# EAGLE schematic Vorlage ATmega2560-16AU (EAGLE 9.6.2)
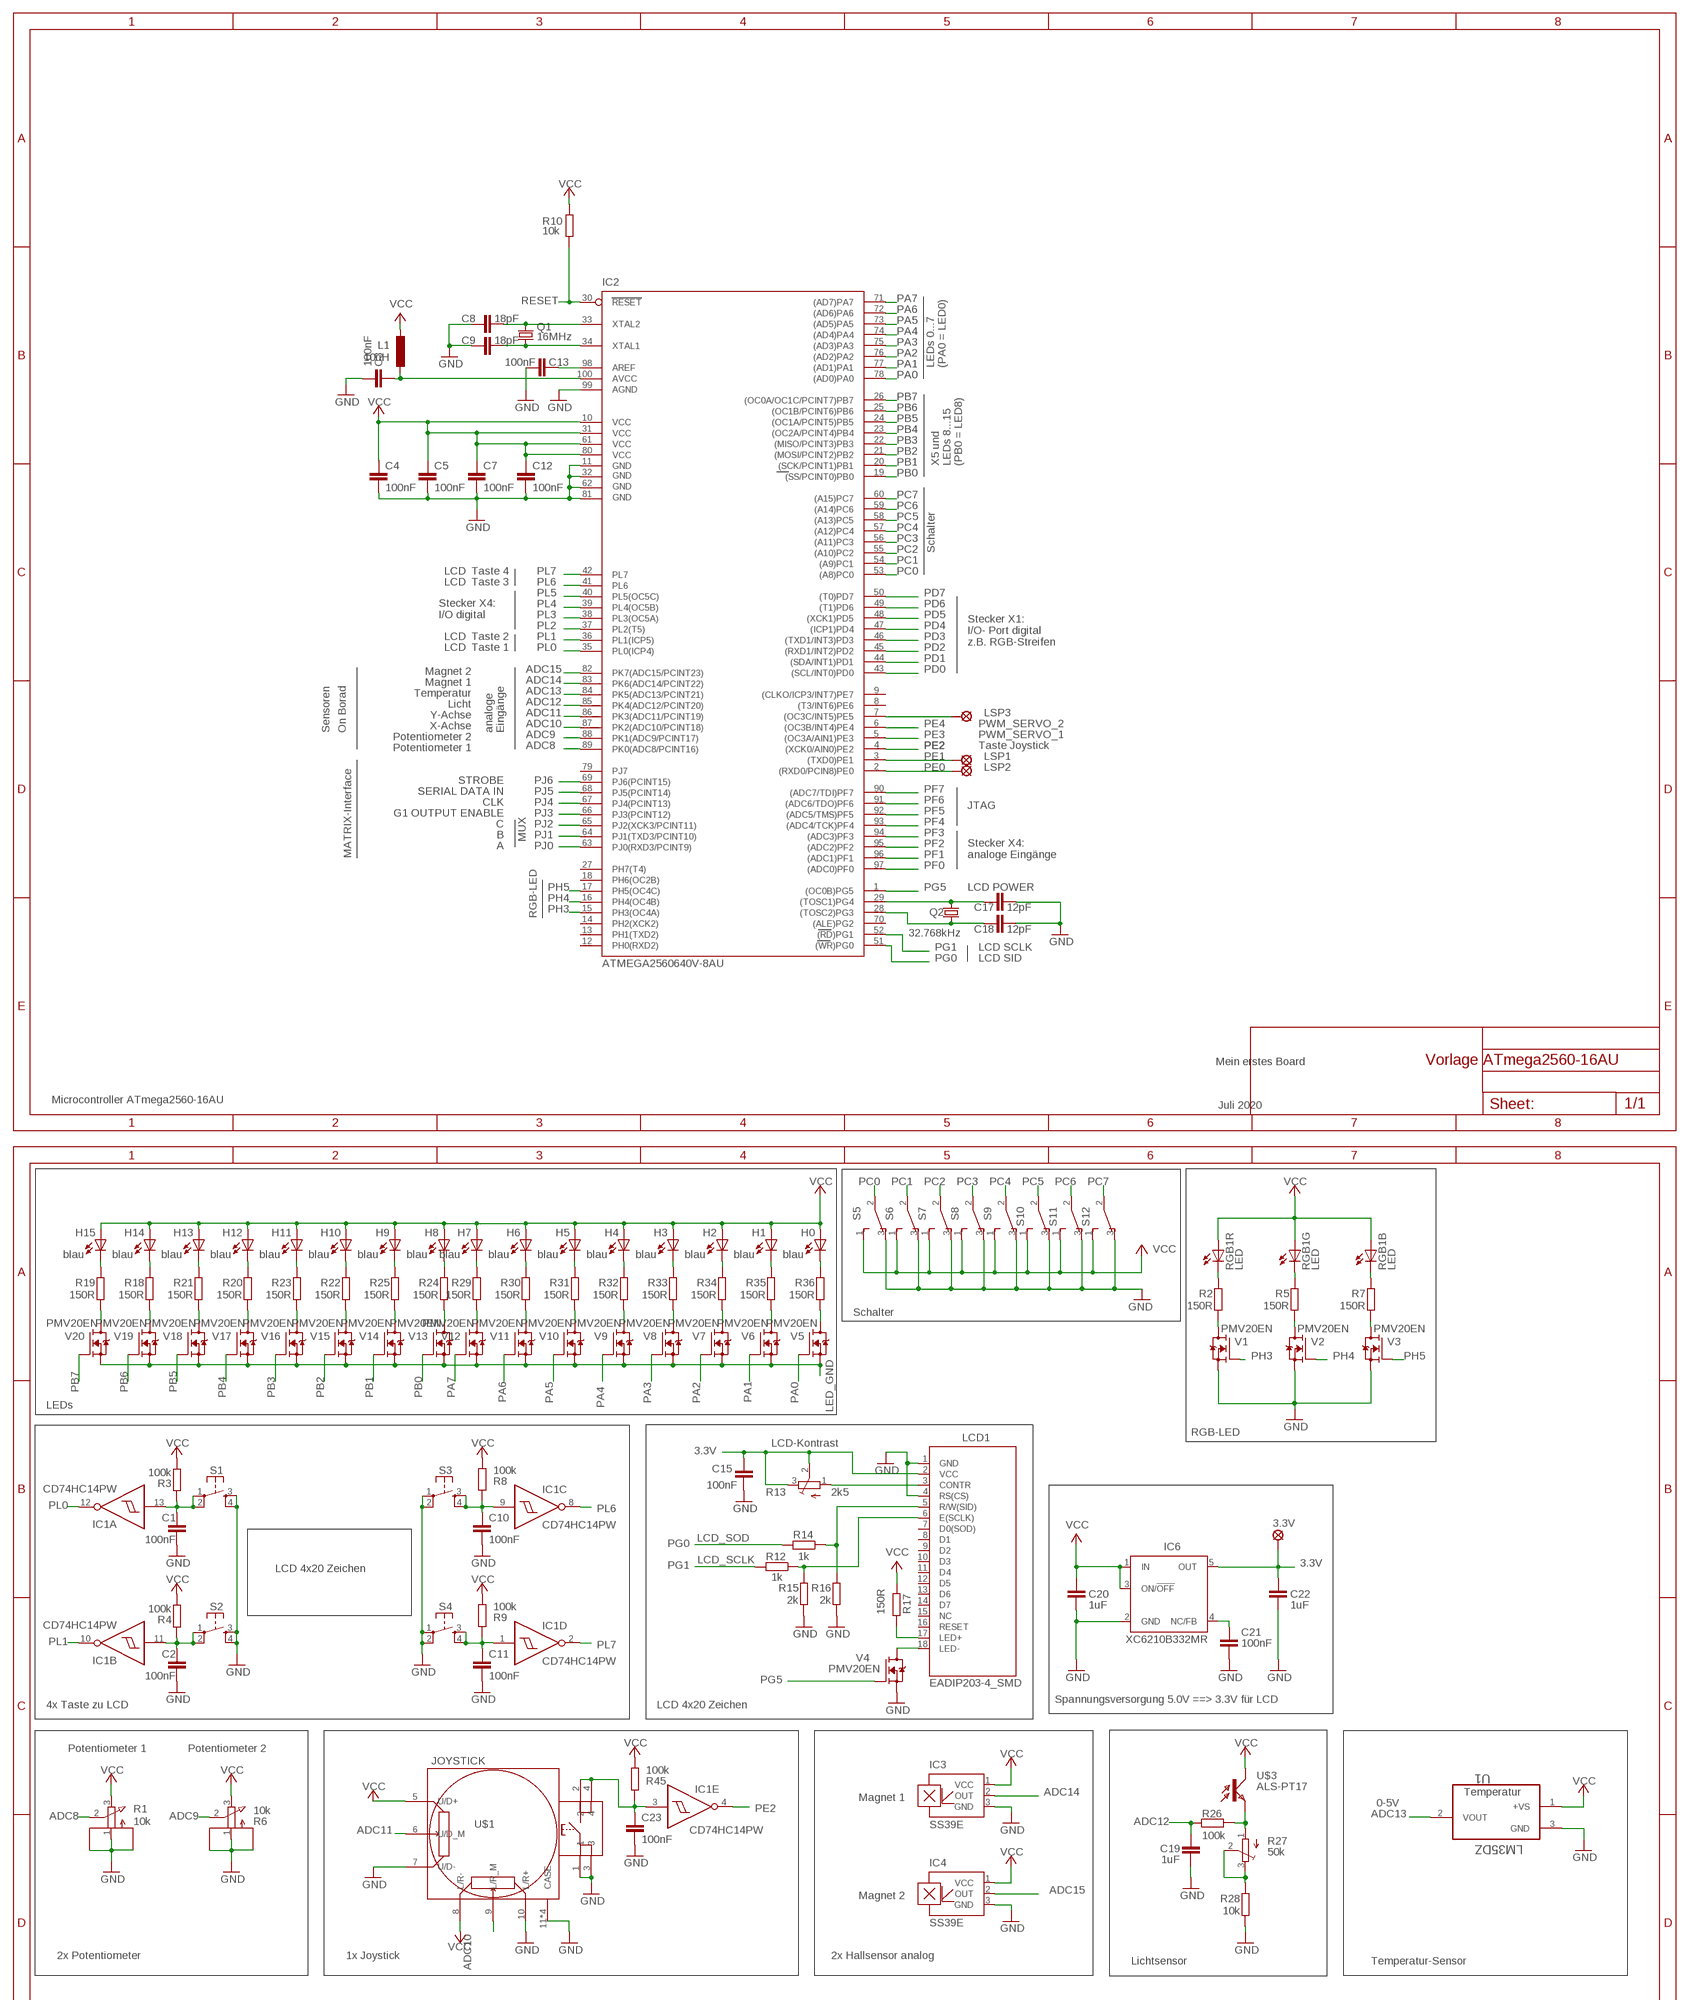
[diagram p0: schematic, sheet 1, part 1 of 2]
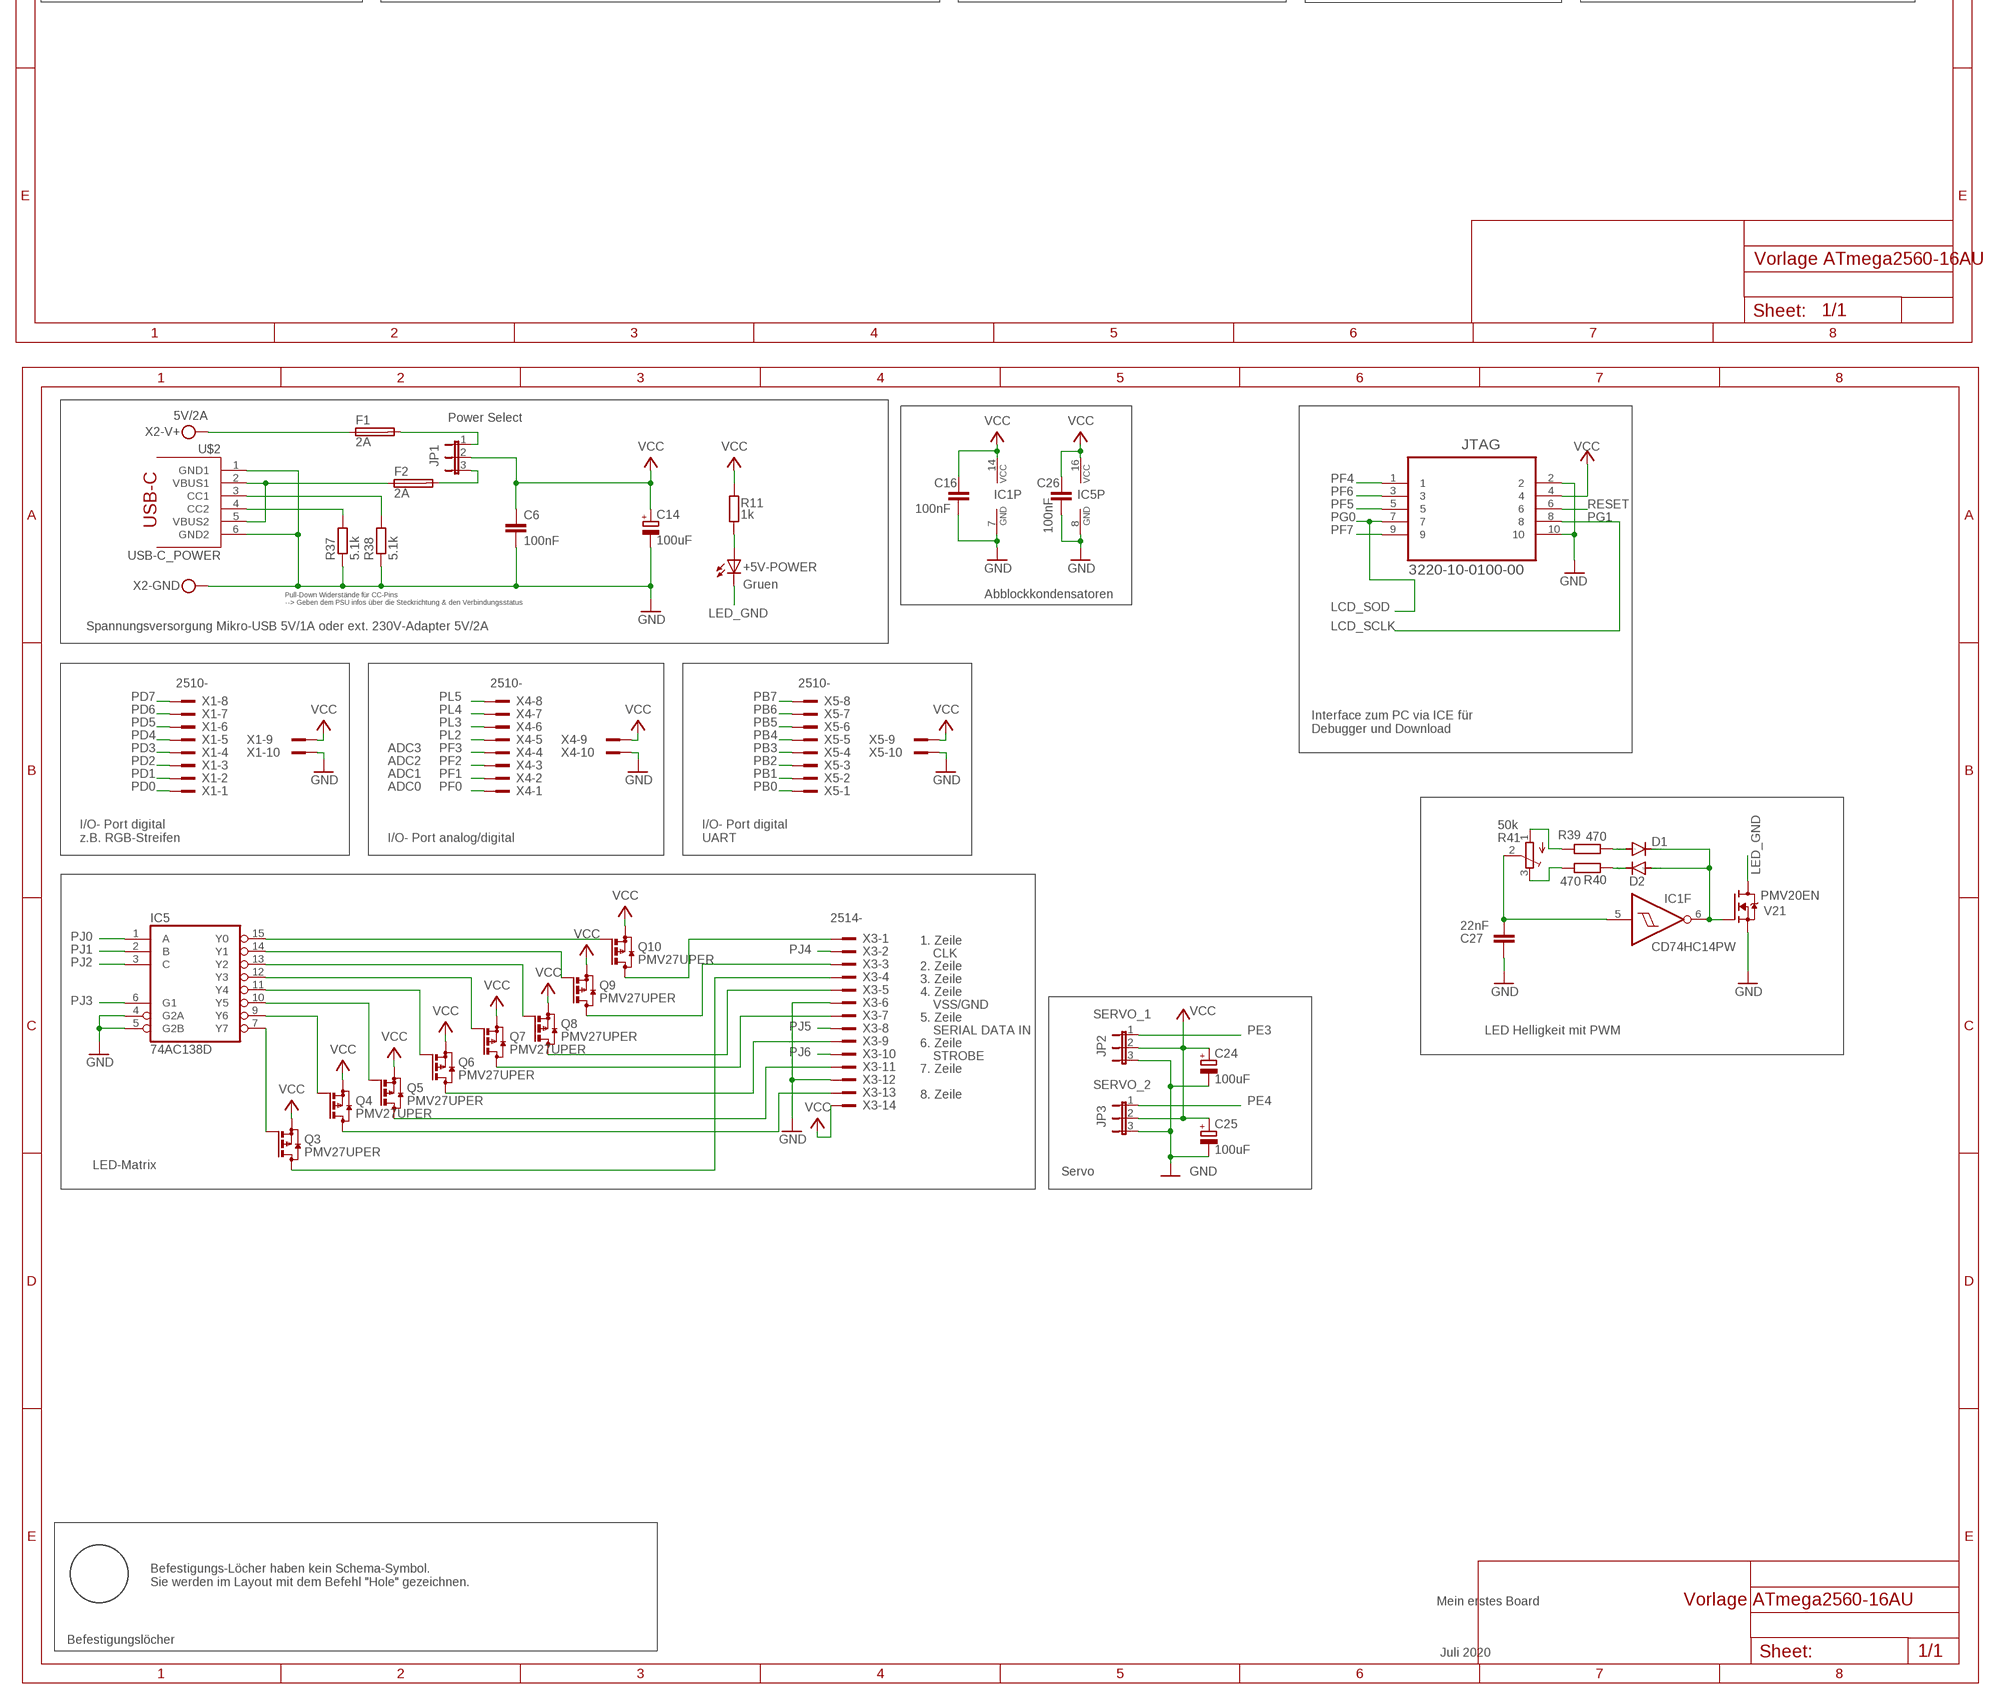
[diagram p1: schematic, sheet 1, part 2 of 2]

## Parts
3.3V  3.3V  LSP11  [LSP11]
+5V-POWER  Gruen  LEDCHIPLED_1206  [CHIPLED_1206]
C1  100nF  C-EUC1206  [C1206]
C2  100nF  C-EUC1206  [C1206]
C3  100nF  C-EUC1206  [C1206]
C4  100nF  C-EUC1206  [C1206]
C5  100nF  C-EUC1206  [C1206]
C6  100nF  C-EUC1206  [C1206]
C7  100nF  C-EUC1206  [C1206]
C8  18pF  C-EUC0805K  [C0805K]
C9  18pF  C-EUC0805K  [C0805K]
C10  100nF  C-EUC1206  [C1206]
C11  100nF  C-EUC1206  [C1206]
C12  100nF  C-EUC1206  [C1206]
C13  100nF  C-EUC1206  [C1206]
C14  100uF  CPOL-EUUD-6,3X8,8  [UD-6,3X5,8_NICHICON]
C15  100nF  C-EUC1206  [C1206]
C16  100nF  C-EUC1206  [C1206]
C17  12pF  C-EUC0805K  [C0805K]
C18  12pF  C-EUC0805K  [C0805K]
C19  1uF  C-EUC1206  [C1206]
C20  1uF  C-EUC1206  [C1206]
C21  100nF  C-EUC1206  [C1206]
C22  1uF  C-EUC1206  [C1206]
C23  100nF  C-EUC1206  [C1206]
C24  100uF  CPOL-EUUD-6,3X8,8  [UD-6,3X5,8_NICHICON]
C25  100uF  CPOL-EUUD-6,3X8,8  [UD-6,3X5,8_NICHICON]
C26  100nF  C-EUC1206  [C1206]
C27  22nF  C-EUC0805  [C0805]
D1  DIODE-SOD123  [SOD123]
D2  DIODE-SOD123  [SOD123]
F1  2A  195601206  [F1206]
F2  2A  195601206  [F1206]
H0  blau  LEDCHIPLED_1206  [CHIPLED_1206]
H1  blau  LEDCHIPLED_1206  [CHIPLED_1206]
H2  blau  LEDCHIPLED_1206  [CHIPLED_1206]
H3  blau  LEDCHIPLED_1206  [CHIPLED_1206]
H4  blau  LEDCHIPLED_1206  [CHIPLED_1206]
H5  blau  LEDCHIPLED_1206  [CHIPLED_1206]
H6  blau  LEDCHIPLED_1206  [CHIPLED_1206]
H7  blau  LEDCHIPLED_1206  [CHIPLED_1206]
H8  blau  LEDCHIPLED_1206  [CHIPLED_1206]
H9  blau  LEDCHIPLED_1206  [CHIPLED_1206]
H10  blau  LEDCHIPLED_1206  [CHIPLED_1206]
H11  blau  LEDCHIPLED_1206  [CHIPLED_1206]
H12  blau  LEDCHIPLED_1206  [CHIPLED_1206]
H13  blau  LEDCHIPLED_1206  [CHIPLED_1206]
H14  blau  LEDCHIPLED_1206  [CHIPLED_1206]
H15  blau  LEDCHIPLED_1206  [CHIPLED_1206]
IC1  CD74HC14PW  7414D  [SO14]
IC2  ATMEGA2560640V-8AU  [TQFP100]
IC3  SS39E  A1301LH  [SOT23-W]
IC4  SS39E  A1301LH  [SOT23-W]
IC5  74AC138D  [SO16]
IC6  XC6210B332MR  LP2985-XXDBVR  [SOT23-DBV]
JP1  Power Select  JP2E  [JP2]
JP2  SERVO_1  JP2E  [JP2]
JP3  SERVO_2  JP2E  [JP2]
JTAG  3220-10-0100-00  FTS-105-01-L-D  [SAMTEC_FTS-105-01-L-D]
L1  10uH  L-EUL2825P  [L2825P]
LCD1  EADIP203-4_SMD  EADIP203-4EADIP203-4SMD  [EADIP203-4SMD]
LSP1  LSP11  [LSP11]
LSP2  LSP11  [LSP11]
LSP3  LSP11  [LSP11]
Q1  16MHz  CRYSTALHC49UP  [HC49UP]
Q2  32.768kHz  CRYSTALTC38H  [TC38H]
Q3  PMV27UPER  BSS84  [SOT23]
Q4  PMV27UPER  BSS84  [SOT23]
Q5  PMV27UPER  BSS84  [SOT23]
Q6  PMV27UPER  BSS84  [SOT23]
Q7  PMV27UPER  BSS84  [SOT23]
Q8  PMV27UPER  BSS84  [SOT23]
Q9  PMV27UPER  BSS84  [SOT23]
Q10  PMV27UPER  BSS84  [SOT23]
R1  10k  EVUA  [EVUF]
R2  150R  R-EU_R1206  [R1206]
R3  100k  R-EU_R1206  [R1206]
R4  100k  R-EU_R1206  [R1206]
R5  150R  R-EU_R1206  [R1206]
R6  10k  EVUA  [EVUF]
R7  150R  R-EU_R1206  [R1206]
R8  100k  R-EU_R1206  [R1206]
R9  100k  R-EU_R1206  [R1206]
R10  10k  R-EU_R1206  [R1206]
R11  1k  R-EU_R1206  [R1206]
R12  1k  R-EU_R1206  [R1206]
R13  2k5  TRIM_EU-3223G  [3223G]
R14  1k  R-EU_R1206  [R1206]
R15  2k  R-EU_R1206  [R1206]
R16  2k  R-EU_R1206  [R1206]
R17  150R  R-EU_R1206  [R1206]
R18  150R  R-EU_R1206  [R1206]
R19  150R  R-EU_R1206  [R1206]
R20  150R  R-EU_R1206  [R1206]
R21  150R  R-EU_R1206  [R1206]
R22  150R  R-EU_R1206  [R1206]
R23  150R  R-EU_R1206  [R1206]
R24  150R  R-EU_R1206  [R1206]
R25  150R  R-EU_R1206  [R1206]
R26  100k  R-EU_R1206  [R1206]
R27  50k  TRIM_EU-3223G  [3223G]
R28  10k  R-EU_R1206  [R1206]
R29  150R  R-EU_R1206  [R1206]
R30  150R  R-EU_R1206  [R1206]
R31  150R  R-EU_R1206  [R1206]
R32  150R  R-EU_R1206  [R1206]
R33  150R  R-EU_R1206  [R1206]
R34  150R  R-EU_R1206  [R1206]
R35  150R  R-EU_R1206  [R1206]
R36  150R  R-EU_R1206  [R1206]
R37  5.1k  R-EU_R0805  [R0805]
R38  5.1k  R-EU_R0805  [R0805]
R39  470  R-EU_R0805  [R0805]
R40  470  R-EU_R0805  [R0805]
R41  50k  TRIM_EU-3223G  [3223G]
R45  100k  R-EU_R1206  [R1206]
RGB1  LED  GM5WA94310AMIT_DIFUSOR  [LED_MIT_DIFUSOR]
S1  TS42_4PAD  [TS42_4PAD]
S2  TS42_4PAD  [TS42_4PAD]
S3  TS42_4PAD  [TS42_4PAD]
S4  TS42_4PAD  [TS42_4PAD]
S5  TL36POSPDT_5MM  [SPDT_5MM]
S6  TL36POSPDT_5MM  [SPDT_5MM]
S7  TL36POSPDT_5MM  [SPDT_5MM]
S8  TL36POSPDT_5MM  [SPDT_5MM]
S9  TL36POSPDT_5MM  [SPDT_5MM]
S10  TL36POSPDT_5MM  [SPDT_5MM]
S11  TL36POSPDT_5MM  [SPDT_5MM]
S12  TL36POSPDT_5MM  [SPDT_5MM]
U1  LM35DZ  [TO127P254X495-3P]
U$1  JOYSTICK  [RKJXV1224005]
U$2  USB-C_POWER  [USB-C]
U$3  ALS-PT17  ALS-PT17-51C  [SOD232-W]
V1  PMV20EN  BSS138  [SOT23]
V2  PMV20EN  BSS138  [SOT23]
V3  PMV20EN  BSS138  [SOT23]
V4  PMV20EN  BSS138  [SOT23]
V5  PMV20EN  BSS138  [SOT23]
V6  PMV20EN  BSS138  [SOT23]
V7  PMV20EN  BSS138  [SOT23]
V8  PMV20EN  BSS138  [SOT23]
V9  PMV20EN  BSS138  [SOT23]
V10  PMV20EN  BSS138  [SOT23]
V11  PMV20EN  BSS138  [SOT23]
V12  PMV20EN  BSS138  [SOT23]
V13  PMV20EN  BSS138  [SOT23]
V14  PMV20EN  BSS138  [SOT23]
V15  PMV20EN  BSS138  [SOT23]
V16  PMV20EN  BSS138  [SOT23]
V17  PMV20EN  BSS138  [SOT23]
V18  PMV20EN  BSS138  [SOT23]
V19  PMV20EN  BSS138  [SOT23]
V20  PMV20EN  BSS138  [SOT23]
V21  PMV20EN  BSS138  [SOT23]
X1  2510-  [PAK100/2500-10]
X2  +5V  MKDSN1,5/2-5,08  [MKDSN1,5/2-5,08]
X3  2514-  [PAK100/2500-14]
X4  2510-  [PAK100/2500-10]
X5  2510-  [PAK100/2500-10]

## Nets
3.3V: 3.3V.MP C15.1 C22.1 IC6.5(OUT) LCD1.2(VCC) R13.2(S) R13.3(E)
ADC8: IC2.89(PK0(ADC8/PCINT16)) R1.2(S)
ADC9: IC2.88(PK1(ADC9/PCINT17)) R6.2(S)
ADC10: IC2.87(PK2(ADC10/PCINT18)) U$1.9(L/R_M)
ADC11: IC2.86(PK3(ADC11/PCINT19)) U$1.6(U/D_M)
ADC12: C19.2 IC2.85(PK4(ADC12/PCINT20)) R26.1
ADC13: IC2.84(PK5(ADC13/PCINT21)) U1.2(VOUT)
ADC14: IC2.83(PK6(ADC14/PCINT22)) IC3.2(OUT)
ADC15: IC2.82(PK7(ADC15/PCINT23)) IC4.2(OUT)
GND [POWER]: C1.2 C2.2 C3.1 C4.2 C5.2 C6.2 C7.2 C8.1 C9.2 C10.2 C11.2 C12.2 C13.1 C14.- C15.2 C16.2 C17.2 C18.2 C19.1 C20.2 C21.2 C22.2 C23.2 C24.- C25.- C26.2 C27.2 IC1.7(P:GND) IC2.11(GND) IC2.32(GND1) IC2.62(GND2) IC2.81(GND3) IC2.99(AGND) IC3.3(GND) IC4.3(GND) IC5.4(G2A) IC5.5(G2B) IC5.8(GND) IC6.2(GND) JP2.3 JP3.3 JTAG.2 JTAG.10 LCD1.1(GND) LCD1.4(RS(CS)) R1.1(A) R1.M1 R1.M2 R6.1(A) R6.M1 R6.M2 R15.1 R16.1 R28.1 R37.1 R38.1 S1.3 S1.4 S2.3 S2.4 S3.1 S3.2 S4.1 S4.2 S5.3(O) S6.3(O) S7.3(O) S8.3(O) S9.3(O) S10.3(O) S11.3(O) S12.3(O) U1.3(GND) U$1.1 U$1.3 U$1.7(U/D-) U$1.10(L/R+) U$1.11(CASE) U$1.12(CASE) U$1.15(CASE) U$1.16(CASE) U$2.1(GND1) U$2.6(GND2) V1.2(S) V2.2(S) V3.2(S) V4.2(S) V21.2(S) X1.10 X2.1.1 X2.1.2 X3.6 X3.12 X4.10 X5.10
H1: H15.C R19.2
H7: H7.C R29.2
LED_GND [POWER]: +5V-POWER.C V5.2(S) V6.2(S) V7.2(S) V8.2(S) V9.2(S) V10.2(S) V11.2(S) V12.2(S) V13.2(S) V14.2(S) V15.2(S) V16.2(S) V17.2(S) V18.2(S) V19.2(S) V20.2(S) V21.3(D)
N$1: R7.2 RGB1.1(B:C)
N$2: R5.2 RGB1.2(G:C)
N$3 [POWER]: F1.2 JP1.1
N$4 [POWER]: F2.2 JP1.3
N$5: R36.1 V5.3(D)
N$6: R35.1 V6.3(D)
N$7: R34.1 V7.3(D)
N$8: R38.2 U$2.3(CC1)
N$9: C23.1 IC1.3(E:I) R45.1 U$1.2 U$1.4
N$10: R37.2 U$2.4(CC2)
N$11: R2.2 RGB1.3(R:C)
N$12: LCD1.18(LED-) V4.3(D)
N$13: R33.1 V8.3(D)
N$14: R32.1 V9.3(D)
N$15: R31.1 V10.3(D)
N$16: R30.1 V11.3(D)
N$17: R29.1 V12.3(D)
N$18: IC2.7((OC3C/INT5)PE5) LSP3.MP
N$19: R26.2 R27.1(A) U$3.E
N$20: R27.2(S) R27.3(E) R28.2
N$21: C1.1 IC1.13(A:I) R3.2 S1.1 S1.2
N$22: C2.1 IC1.11(B:I) R4.2 S2.1 S2.2
N$23: C11.1 IC1.1(D:I) R9.1 S4.3 S4.4
N$24: C10.1 IC1.9(C:I) R8.1 S3.3 S3.4
N$25: C9.1 IC2.34(XTAL1) Q1.1
N$26: C3.2 IC2.100(AVCC) L1.2
N$27: R2.1 V1.3(D)
N$28: R5.1 V2.3(D)
N$29: R7.1 V3.3(D)
N$30: C13.2 IC2.98(AREF)
N$31 [POWER]: F2.1 U$2.2(VBUS1) U$2.5(VBUS2)
N$32: C17.1 IC2.29((TOSC1)PG4) Q2.1
N$33: H6.C R30.2
N$34: LCD1.3(CONTR) R13.1(A)
N$35: C18.1 IC2.28((TOSC2)PG3) Q2.2
N$36: D1.C D2.A IC1.6(F:O) V21.1(G)
N$37: C8.2 IC2.33(XTAL2) Q1.2
N$38: D1.A R39.1
N$39: LCD1.6(E(SCLK)) R12.1 R15.2
N$40: LCD1.5(R/W(SID)) R14.1 R16.2
N$41: D2.C R40.1
N$42: R39.2 R41.1(A)
N$43: R40.2 R41.3(E)
N$44: C27.1 IC1.5(F:I) R41.2(S)
N$46: H14.C R18.2
N$47: H12.C R20.2
N$48: H2.C R34.2
N$49: H4.C R32.2
N$50: H5.C R31.2
N$51: H13.C R21.2
N$52: H10.C R22.2
N$53: H3.C R33.2
N$55: H11.C R23.2
N$56: H8.C R24.2
N$57: H0.C R36.2
N$58: H1.C R35.2
N$59: H9.C R25.2
N$60: +5V-POWER.A R11.1
N$61: R24.1 V13.3(D)
N$63: R25.1 V14.3(D)
N$64: R22.1 V15.3(D)
N$65: R23.1 V16.3(D)
N$66: R20.1 V17.3(D)
N$67: R21.1 V18.3(D)
N$68: R18.1 V19.3(D)
N$69: R19.1 V20.3(D)
N$70: C21.1 IC6.4(NC/FB)
N$75 [POWER]: F1.1 X2.2.1 X2.2.2
N$95: LCD1.17(LED+) R17.1
N$102: IC5.15(Y0) Q10.1(G)
N$103: Q10.3(D) X3.1
N$104: IC5.14(Y1) Q9.1(G)
N$105: IC5.13(Y2) Q8.1(G)
N$106: IC5.12(Y3) Q7.1(G)
N$107: IC5.11(Y4) Q6.1(G)
N$108: IC5.10(Y5) Q5.1(G)
N$109: IC5.9(Y6) Q4.1(G)
N$110: IC5.7(Y7) Q3.1(G)
N$111: Q9.3(D) X3.3
N$112: Q3.3(D) X3.4
N$113: Q8.3(D) X3.5
N$114: Q7.3(D) X3.7
N$115: Q6.3(D) X3.9
N$116: Q5.3(D) X3.11
N$117: Q4.3(D) X3.13
PA0: IC2.78((AD0)PA0) V5.1(G)
PA1: IC2.77((AD1)PA1) V6.1(G)
PA2: IC2.76((AD2)PA2) V7.1(G)
PA3: IC2.75((AD3)PA3) V8.1(G)
PA4: IC2.74((AD4)PA4) V9.1(G)
PA5: IC2.73((AD5)PA5) V10.1(G)
PA6: IC2.72((AD6)PA6) V11.1(G)
PA7: IC2.71((AD7)PA7) V12.1(G)
PB0: IC2.19((SS/PCINT0)PB0) V13.1(G) X5.1
PB1: IC2.20((SCK/PCINT1)PB1) V14.1(G) X5.2
PB2: IC2.21((MOSI/PCINT2)PB2) V15.1(G) X5.3
PB3: IC2.22((MISO/PCINT3)PB3) V16.1(G) X5.4
PB4: IC2.23((OC2A/PCINT4)PB4) V17.1(G) X5.5
PB5: IC2.24((OC1A/PCINT5)PB5) V18.1(G) X5.6
PB6: IC2.25((OC1B/PCINT6)PB6) V19.1(G) X5.7
PB7: IC2.26((OC0A/OC1C/PCINT7)PB7) V20.1(G) X5.8
PC0: IC2.53((A8)PC0) S5.2(P)
PC1: IC2.54((A9)PC1) S6.2(P)
PC2: IC2.55((A10)PC2) S7.2(P)
PC3: IC2.56((A11)PC3) S8.2(P)
PC4: IC2.57((A12)PC4) S9.2(P)
PC5: IC2.58((A13)PC5) S10.2(P)
PC6: IC2.59((A14)PC6) S11.2(P)
PC7: IC2.60((A15)PC7) S12.2(P)
PD0: IC2.43((SCL/INT0)PD0) X1.1
PD1: IC2.44((SDA/INT1)PD1) X1.2
PD2: IC2.45((RXD1/INT2)PD2) X1.3
PD3: IC2.46((TXD1/INT3)PD3) X1.4
PD4: IC2.47((ICP1)PD4) X1.5
PD5: IC2.48((XCK1)PD5) X1.6
PD6: IC2.49((T1)PD6) X1.7
PD7: IC2.50((T0)PD7) X1.8
PE0: IC2.2((RXD0/PCIN8)PE0) LSP2.MP
PE1: IC2.3((TXD0)PE1) LSP1.MP
PE2: IC1.4(E:O) IC2.4((XCK0/AIN0)PE2)
PE3: IC2.5((OC3A/AIN1)PE3) JP2.1
PE4: IC2.6((OC3B/INT4)PE4) JP3.1
PF0: IC2.97((ADC0)PF0) X4.1
PF1: IC2.96((ADC1)PF1) X4.2
PF2: IC2.95((ADC2)PF2) X4.3
PF3: IC2.94((ADC3)PF3) X4.4
PF4: IC2.93((ADC4/TCK)PF4) JTAG.1
PF5: IC2.92((ADC5/TMS)PF5) JTAG.5
PF6: IC2.91((ADC6/TDO)PF6) JTAG.3
PF7: IC2.90((ADC7/TDI)PF7) JTAG.9
PG0: IC2.51((WR)PG0) JTAG.7 R14.2
PG1: IC2.52((RD)PG1) JTAG.8 R12.2
PG5: IC2.1((OC0B)PG5) V4.1(G)
PH3: IC2.15(PH3(OC4A)) V1.1(G)
PH4: IC2.16(PH4(OC4B)) V2.1(G)
PH5: IC2.17(PH5(OC4C)) V3.1(G)
PJ0: IC2.63(PJ0(RXD3/PCINT9)) IC5.1(A)
PJ1: IC2.64(PJ1(TXD3/PCINT10)) IC5.2(B)
PJ2: IC2.65(PJ2(XCK3/PCINT11)) IC5.3(C)
PJ3: IC2.66(PJ3(PCINT12)) IC5.6(G1)
PJ4: IC2.67(PJ4(PCINT13)) X3.2
PJ5: IC2.68(PJ5(PCINT14)) X3.8
PJ6: IC2.69(PJ6(PCINT15)) X3.10
PL0: IC1.12(A:O) IC2.35(PL0(ICP4))
PL1: IC1.10(B:O) IC2.36(PL1(ICP5))
PL2: IC2.37(PL2(T5)) X4.5
PL3: IC2.38(PL3(OC5A)) X4.6
PL4: IC2.39(PL4(OC5B)) X4.7
PL5: IC2.40(PL5(OC5C)) X4.8
PL6: IC1.8(C:O) IC2.41(PL6)
PL7: IC1.2(D:O) IC2.42(PL7)
RESET: IC2.30(RESET) JTAG.6 R10.1
VCC [POWER]: C4.1 C5.1 C6.1 C7.1 C12.1 C14.+ C16.1 C20.1 C24.+ C25.+ C26.1 H0.A H1.A H2.A H3.A H4.A H5.A H6.A H7.A H8.A H9.A H10.A H11.A H12.A H13.A H14.A H15.A IC1.14(P:VCC) IC2.10(VCC) IC2.31(VCC1) IC2.61(VCC2) IC2.80(VCC3) IC3.1(VCC) IC4.1(VCC) IC5.16(VCC) IC6.1(IN) IC6.3(ON/!OFF) JP1.2 JP2.2 JP3.2 JTAG.4 L1.1 Q3.2(S) Q4.2(S) Q5.2(S) Q6.2(S) Q7.2(S) Q8.2(S) Q9.2(S) Q10.2(S) R1.3(E) R3.1 R4.1 R6.3(E) R8.2 R9.2 R10.2 R11.2 R17.2 R45.2 RGB1.4(R:A) RGB1.5(G:A) RGB1.6(B:A) S5.1(S) S6.1(S) S7.1(S) S8.1(S) S9.1(S) S10.1(S) S11.1(S) S12.1(S) U1.1(+VS) U$1.5(U/D+) U$1.8(L/R-) U$3.C X1.9 X3.14 X4.9 X5.9
Unconnected: IC2.8((T3/INT6)PE6) IC2.9((CLKO/ICP3/INT7)PE7) IC2.12(PH0(RXD2)) IC2.13(PH1(TXD2)) IC2.14(PH2(XCK2)) IC2.18(PH6(OC2B)) IC2.27(PH7(T4)) IC2.70((ALE)PG2) IC2.79(PJ7) LCD1.7(D0(SOD)) LCD1.8(D1) LCD1.9(D2) LCD1.10(D3) LCD1.11(D4) LCD1.12(D5) LCD1.13(D6) LCD1.14(D7) LCD1.15(NC) LCD1.16(RESET)

## Notes on the sheet
- LEDs 0...7
  (PA0 = LED0)
- X5 und
  LEDs 8...15
  (PB0 = LED8)
- Schalter
- LCD | Taste 4
- LCD | Taste 3
- Stecker X4:
  I/O digital
- LCD | Taste 2
- Stecker X1:
  I/O- Port digital
  z.B. RGB-Streifen
- LCD | Taste 1
- Magnet 2
- Magnet 1
- Temperatur
- Licht
- Y-Achse
- X-Achse
- PWM_SERVO_2
- Sensoren | On Borad | Potentiometer 2
- analoge
  Eingänge
- PWM_SERVO_1
- Potentiometer 1
- Taste Joystick
- STROBE
- SERIAL DATA IN
- CLK
- G1 OUTPUT ENABLE | JTAG
- C
- B
- A | MUX
- MATRIX-Interface
- Stecker X4:
  analoge Eingänge
- LCD POWER
- RGB-LED
- LCD SCLK
- LCD SID
- Mein erstes Board
- Microcontroller ATmega2560-16AU
- Juli 2020
- Schalter
- LEDs
- RGB-LED
- LCD-Kontrast
- LCD_SOD
- LCD_SCLK
- LCD 4x20 Zeichen
- Spannungsversorgung 5.0V ==> 3.3V für LCD
- 4x Taste zu LCD | LCD 4x20 Zeichen
- Potentiometer 1 | Potentiometer 2
- Magnet 1
- 0-5V
- Magnet 2
- 2x Potentiometer | 1x Joystick | 2x Hallsensor analog
- Lichtsensor | Temperatur-Sensor
- 5V/2A
- Abblockkondensatoren
- Pull-Down Widerstände für CC-Pins
  --> Geben dem PSU infos über die Steckrichtung & den Verbindungsstatus
- LCD_SOD
- Spannungsversorgung Mikro-USB 5V/1A oder ext. 230V-Adapter 5V/2A | LCD_SCLK
- Interface zum PC via ICE für
  Debugger und Download
- ADC3
- ADC2
- ADC1
- ADC0
- I/O- Port digital
  z.B. RGB-Streifen
- I/O- Port analog/digital
- I/O- Port digital
  UART
- 1. Zeile
- CLK
- 2. Zeile
- 3. Zeile
- 4. Zeile
- VSS/GND
- 5. Zeile
- SERIAL DATA IN | LED Helligkeit mit PWM
- 6. Zeile
- STROBE
- 7. Zeile
- 8. Zeile
- LED-Matrix
- Servo
- Befestigungs-Löcher haben kein Schema-Symbol.
  Sie werden im Layout mit dem Befehl "Hole" gezeichnen.
- Mein erstes Board
- Befestigungslöcher
- Juli 2020

## Library data of the parts
3.3V LSP1-LSP3 = solpad:LSP11: SOLDER PAD drill 1.1 mm
+5V-POWER H0 H1-H15 = led:LED: LED OSRAM: - CHIPLED LG R971, LG N971, LY N971, LG Q971, LY Q971, LO R971, LY R971 LH N974, LH R974 LS Q976, LO Q976, LY Q976 LO Q996 - Hyper CHIPLED LW Q18S LB Q993, LB Q99A, LB R99A - SideLED LS A670, LO A670, LY A670, LG A670, LP A670 LB A673, LV A673, LT A673, LW A673 LH A674 LY A675 LS A676, LA A676, LO A676, LY A676, LW A676 LS A679, LY A679, LG A679 - Hyper Micro SIDELED® LS Y876, LA Y876, LO Y876, LY Y876 LT Y87S - SmartLED LW L88C, LW L88S LB L89C, LB L89S, LG L890 LS L89K, LO L89K, LY L89K LS L896, LA L896, LO L896, LY L896 - TOPLED LS T670, LO T670, LY T670, LG T670, LP T670 LSG T670, LSP T670, LSY T670, LOP T670, LYG T670 LG T671, LOG T671, LSG T671 LB T673, LV T673, LT T673, LW T673 LH T674 LS T676, LA T676, LO T676, LY T676, LB T676, LH T676, LSB T676, LW T676 LB T67C, LV T67C, LT T67C, LS T67K, LO T67K, LY T67K, LW E67C LS E67B, LA E67B, LO E67B, LY E67B, LB E67C, LV E67C, LT E67C LW T67C LS T679, LY T679, LG T679 LS T770, LO T770, LY T770, LG T770, LP T770 LB T773, LV T773, LT T773, LW T773 LH T774 LS E675, LA E675, LY E675, LS T675 LS T776, LA T776, LO T776, LY T776, LB T776 LHGB T686 LT T68C, LB T68C - Hyper Mini TOPLED® LB M676 - Mini TOPLED Santana® LG M470 LS M47K, LO M47K, LY M47K Source: http://www.osram.convergy.de LUXEON: - LUMILED® LXK2-PW12-R00, LXK2-PW12-S00, LXK2-PW14-U00, LXK2-PW14-V00 LXK2-PM12-R00, LXK2-PM12-S00, LXK2-PM14-U00 LXK2-PE12-Q00, LXK2-PE12-R00, LXK2-PE12-S00, LXK2-PE14-T00, LXK2-PE14-U00 LXK2-PB12-K00, LXK2-PB12-L00, LXK2-PB12-M00, LXK2-PB14-N00, LXK2-PB14-P00, LXK2-PB14-Q00 LXK2-PR12-L00, LXK2-PR12-M00, LXK2-PR14-Q00, LXK2-PR14-R00 LXK2-PD12-Q00, LXK2-PD12-R00, LXK2-PD12-S00 LXK2-PH12-R00, LXK2-PH12-S00 LXK2-PL12-P00, LXK2-PL12-Q00, LXK2-PL12-R00 Source: www.luxeon.com KINGBRIGHT: KA-3528ASYC Source: www.kingbright.com
C1-C13 C15-C23 C26 C27 = rcl:C-EU: CAPACITOR, European symbol; SPICEPREFIX: C
C14 C24 C25 = rcl2:CPOL-EU: POLARIZED CAPACITOR, European symbol
D1 D2 = diode:DIODE-: DIODE
F1 F2 = fuse:19560: FUSE HOLDER TR5, Wickmann
IC1 = 74xx-eu:74*14: Hex schmitt trigger INVERTER
IC2 = SmartPrj-B:ATMEGA2560: MICROCONTROLLER 64/128/256 Kbytes FLASH 4 Kbytes EEPROM 8 Kbytes SRAM 86 General Purpose I/O pins 12-channels16-bit PWM 4 x Serial USARTs 16-channels 10-bit A/D
IC3 IC4 = allegro-2:A13*?: Linear Hall Effect Sensor ICs Continuous-Time Ratiometric High-Temperature Operation Programmable Linear with Analog Output A1302 -Replacement- UGN3503 Source: http://www.allegromicro.com/en/Products/Part_Numbers/1301/1301.pdf http://www.allegromicro.com/en/Products/Part_Numbers/1321/1321.pdf http://www.allegromicro.com/en/Products/Part_Numbers/1381/1381.pdf; MF: ALLEGRO MICROSYSTEMS, INC.; MPN: A1301ELHLT-T; OC_FARNELL: 1198084; OC_NEWARK: 31K6634
IC5 = 74xx-eu:74*138: 3-line to 8-line DECODER/DEMULTIPLEXER
IC6 = SmartPrj:LP2985-XXDBVR: ULTRALOW-POWER 50-mA LOW-DROPOUT LINEAR REGULATORS 50-mA Low-Dropout Regulator Source: http://focus.ti.com/lit/ds/symlink/tps77001.pdf
JP1-JP3 = jumper_l:JP2E: JUMPER
JTAG = JTAG_10pol_50mil:FTS-105-01-L-D; DESCRIPTION: CONN HEADER, 1.27MM, THRU HOLE, 10WAY; MPN: FTS-105-01-L-D; OCFARNELL: 1667728; OCNEWARK: 11P4652; PACKAGE: HEADER, 1.27MM, THRU HOLE, 10WAY; SUPPLIER: Samtec
L1 = rcl:L-EU: INDUCTOR, European symbol; SPICEPREFIX: L
LCD1 = display-lcd:EADIP203-4
Q1 Q2 = crystal:CRYSTAL: CRYSTAL; OC_FARNELL: unknown; OC_NEWARK: unknown
Q3-Q10 = transistor-small-signal:BSS84: P-CHANNEL MOS FET
R1 R6 = pot-Sirius:EVU: 9 mm Square Rotary Potentiometers Source: Panasonic
R2-R5 R7-R12 R14-R26 R28-R36 R45 = rcl:R-EU_: RESISTOR, European symbol; SPICEPREFIX: R
R13 R27 R41 = pot:TRIM_EU-: POTENTIOMETER
R37-R40 = rcl:R-EU_: RESISTOR, European symbol
RGB1 = led:GM5WA94310A: Chip LED RGB Source: http://document.sharpsma.com/files/GM5WA94310A_SS.pdf
S1-S4 = SmartPrj:TS42_4PAD
S5-S12 = switch:TL36PO: TINY SWITCH ON - ON Source: http://www2.produktinfo.conrad.com/datenblaetter/700000-724999/705152-da-01-de-Subminiaturschalter_TL_36YO.pdf
U1 = Temp_Sensor LM35:LM35DZ: IC, TEMPERATURE SENSOR, ± 0.4°C; MPN: LM35DZ; OC_FARNELL: 9488200; OC_NEWARK: 92F288; PACKAGE: TO-92; SUPPLIER: TEXAS INSTRUMENTS
U$1 = Joystick:JOYSTICK
U$2 = USB:USB-C_POWER
U$3 = Lichtsensor:ALS-PT17-51C
V1-V21 = transistor-fet-mit-BSS138:BSS138
X1 X4 X5 = con-3m:2510-: 3M (TM) Pak 100 4-Wall Header Source: 3M; MF: 3M; MPN: 2510-6002UB; OC_FARNELL: 9838244; OC_NEWARK: 46F4725
X2 = con_sirius:MKDSN1,5/2-5,08: MKDSN 1,5/ 2-5,08 Printklemme Nennstrom: 13,5 A Nennspannung: 250 V Rastermaß: 5,08 mm Polzahl: 2 Anschlussart: Schraubanschluss Montage: Löten Anschlussrichtung Leiter/Platine: 0 ° Artikelnummer: 1729128 Source: http://eshop.phoenixcontact.com .. 1729128.pdf; MPN: MKDSN 1,5/2-5.08; OC_FARNELL: 1792903; OC_NEWARK: 30M2397
X3 = con-3m:2514-: 3M (TM) Pak 100 4-Wall Header Source: 3M; OC_FARNELL: unknown; OC_NEWARK: unknown

## Net classes
0 default: width 0.254 mm, drill 0.508 mm
1 POWER: width 1.016 mm, drill 1.016 mm